# Altium project Ultrasound Smart Probe_Ver2.PrjPcb (part 1 of 9)
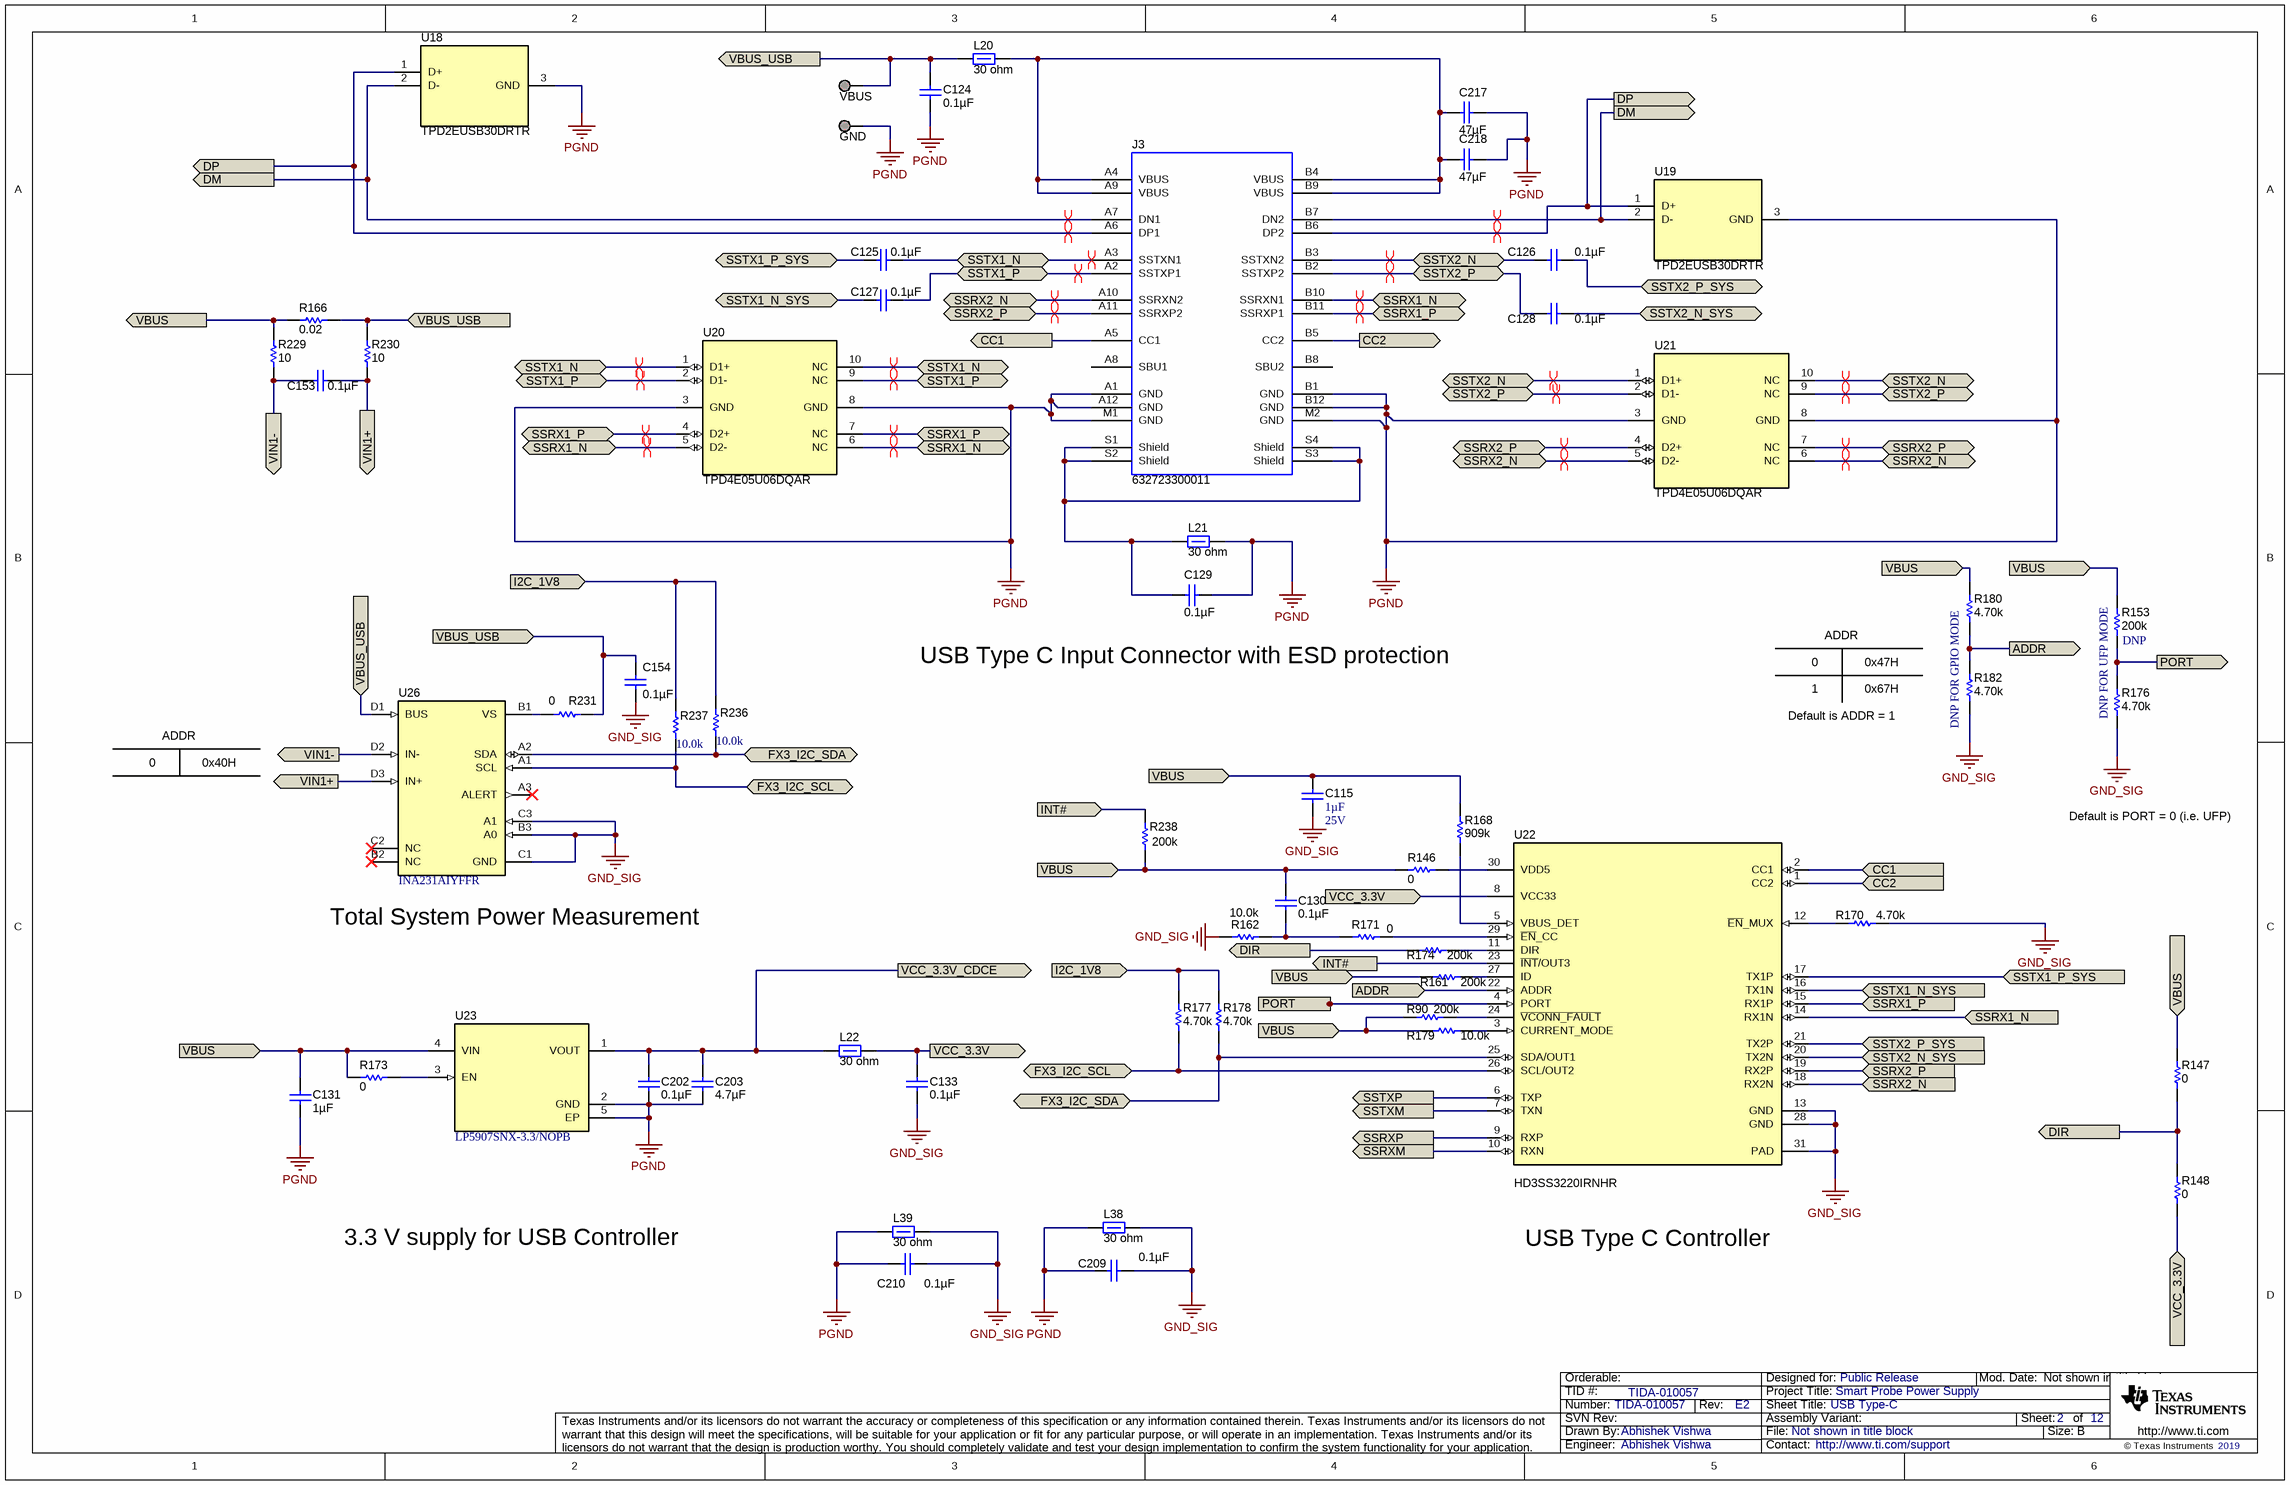
[diagram p0: USB TYPE C Interface.SchDoc]
CopyrightYear: 2019; PCB_Layout: TESSOLVE; PCB_Rev: E2; PRJ_Customer: Public Release; PRJ_Engineer: Abhishek Vishwa; PRJ_Number: TIDA-010057; PRJ_Title: Smart Probe Power Supply; SCH_Rev: E2; TechSupport: http://www.ti.com/support; TID: TIDA-010057
10 sheets, 594 parts. Net scope: flat (ports and power ports of the same name join across sheets).
Board file: TIDA_010057.PcbDoc
Sheets:
  USB TYPE C Interface.SchDoc
  FX3_Interface.SchDoc
  Input Output Connector.SchDoc
  LVPS_FX3_Supply.SchDoc
  LVPS RX Supply 1V8.SchDoc
  LVPS RX Supply 3V3 and 1V2_1.SchDoc
  LVPS FPGA.SchDoc
  LVPS TX Supply 5V and m5V.SchDoc
  High Voltage Power Supply.SchDoc
  EVM_Hardware.SchDoc

## Sheet USB TYPE C Interface.SchDoc: USB Type-C
size 431 x 279 mm; Date: Not shown in title block; ApprovedBy: Not shown in title block; CheckedBy: Not shown in title block; Author: Not shown in title block; CompanyName: Not shown in title block; DrawnBy: Abhishek Vishwa; Engineer: Not shown in title block; Organization: Not shown in title block; Address1: Not shown in title block; Address2: Not shown in title block; Address3: Not shown in title block; Address4: Not shown in title block; DocumentNumber: 1; Revision: Use project parameter SCH_Rev; SheetNumber: 2; SheetTotal: 12; PageSetup: Record=PageOptions|CenterHorizontal=True|CenterVertical=True|PrintScale=1.00|XCorrection=1.00|YCorrection=1.00|PrintKind=0|BorderSize=5000000|LeftOffset=0|BottomOffset=0|Orientation=2|PaperLength=1000|PaperWidth=1000|Scale=100|PaperSource=15|PrintQuality=600|MediaType=1|DitherType=10|PaperKind=Letter|PrintScaleMode=1; CurrentTime: Not shown in title block; CurrentDate: Not shown in title block; Time: Not shown in title block; DocumentFullPathAndName: Not shown in title block; DocumentName: Not shown in title block; ModifiedDate: Not shown in title block; ImagePath: Not shown in title block

### Parts
C115  ValueDisplayed: 1µF  VDC_V: 25V  [0402]  (hidden comment: CL05A105KA5NQNC)
C124  ValueDisplayed: 0.1µF  [0402]  (hidden comment: GRM155R61E104KA87D)
C125  ValueDisplayed: 0.1µF  [0201_033]  (hidden comment: C0603X6S1C104K030BC)
C126  ValueDisplayed: 0.1µF  [0201_033]  (hidden comment: C0603X6S1C104K030BC)
C127  ValueDisplayed: 0.1µF  [0201_033]  (hidden comment: C0603X6S1C104K030BC)
C128  ValueDisplayed: 0.1µF  [0201_033]  (hidden comment: C0603X6S1C104K030BC)
C129  ValueDisplayed: 0.1µF  [0402]  (hidden comment: GRM155R61E104KA87D)
C130  ValueDisplayed: 0.1µF  [0402]  (hidden comment: GRM155R61E104KA87D)
C131  ValueDisplayed: 1µF  [0603]  (hidden comment: 885012206052)
C133  ValueDisplayed: 0.1µF  [0402]  (hidden comment: GRM155R61E104KA87D)
C153  ValueDisplayed: 0.1µF  [0201_033]  (hidden comment: C0603X6S1C104K030BC)
C154  ValueDisplayed: 0.1µF  [0201_033]  (hidden comment: C0603X6S1C104K030BC)
C202  ValueDisplayed: 0.1µF  [0402]  (hidden comment: GRM155R61E104KA87D)
C203  ValueDisplayed: 4.7µF  [0603]  (hidden comment: GRM188R61A475MAAJ)
C209  ValueDisplayed: 0.1µF  [0402]  (hidden comment: GRM155R61E104KA87D)
C210  ValueDisplayed: 0.1µF  [0402]  (hidden comment: GRM155R61E104KA87D)
C217  ValueDisplayed: 47µF  [0603]  (hidden comment: GRM188R60J476ME15D)
C218  ValueDisplayed: 47µF  [0603]  (hidden comment: GRM188R60J476ME15D)
GND  TESTPOINT  [TP_50MIL-25MILHOLE]  (value not drawn)  (no BOM)
J3  632723300011  [Wurth_632_723_300_011]
L20  ValueDisplayed: 30 ohm  [0603]  (hidden comment: 742792609)
L21  ValueDisplayed: 30 ohm  [0603]  (hidden comment: 742792609)
L22  ValueDisplayed: 30 ohm  [0603]  (hidden comment: 742792609)
L38  ValueDisplayed: 30 ohm  [0603]  (hidden comment: 742792609)
L39  ValueDisplayed: 30 ohm  [0603]  (hidden comment: 742792609)
R90  ValueDisplayed: 200k  [0402]  (hidden comment: ERJ-2RKF2003X)
R146  ValueDisplayed: 0  [0402]  (hidden comment: ERJ-2GE0R00X)
R147  ValueDisplayed: 0  [0402]  (hidden comment: ERJ-2GE0R00X)
R148  ValueDisplayed: 0  [0402]  (hidden comment: ERJ-2GE0R00X)
R153  ValueDisplayed: 200k  VARIANT: DNP  [0402]  (hidden comment: ERJ-2RKF2003X)
R161  ValueDisplayed: 200k  [0402]  (hidden comment: ERJ-2RKF2003X)
R162  ValueDisplayed: 10.0k  [0402]  (hidden comment: ERJ-2RKF1002X)
R166  ValueDisplayed: 0.02  [1206]  (hidden comment: CSR1206FK20L0)
R168  ValueDisplayed: 909k  [0402]  (hidden comment: CRCW0402909KFKED)
R170  ValueDisplayed: 4.70k  [0402]  (hidden comment: ERJ-2RKF4701X)
R171  ValueDisplayed: 0  [0402]  (hidden comment: ERJ-2GE0R00X)
R173  ValueDisplayed: 0  [0402]  (hidden comment: ERJ-2GE0R00X)
R174  ValueDisplayed: 200k  [0402]  (hidden comment: ERJ-2RKF2003X)
R176  ValueDisplayed: 4.70k  [0402]  (hidden comment: ERJ-2RKF4701X)
R177  ValueDisplayed: 4.70k  [0402]  (hidden comment: ERJ-2RKF4701X)
R178  ValueDisplayed: 4.70k  [0402]  (hidden comment: ERJ-2RKF4701X)
R179  ValueDisplayed: 10.0k  [0402]  (hidden comment: CRCW040210K0FKED)
R180  ValueDisplayed: 4.70k  [0402]  (hidden comment: ERJ-2RKF4701X)
R182  ValueDisplayed: 4.70k  [0402]  (hidden comment: ERJ-2RKF4701X)
R229  ValueDisplayed: 10  [0201]  (hidden comment: RC0201JR-0710RL)
R230  ValueDisplayed: 10  [0201]  (hidden comment: RC0201JR-0710RL)
R231  ValueDisplayed: 0  [0201]  (hidden comment: ERJ-1GN0R00C)
R236  ValueDisplayed: 10.0k  [0201]  (hidden comment: RC0201FS-7D10KL)
R237  ValueDisplayed: 10.0k  [0201]  (hidden comment: RC0201FS-7D10KL)
R238  ValueDisplayed: 200k  [0402]  (hidden comment: ERJ-2RKF2003X)
U18  TPD2EUSB30DRTR  [DRT0003A]
U19  TPD2EUSB30DRTR  [DRT0003A]
U20  TPD4E05U06DQAR  [DQA0010A]
U21  TPD4E05U06DQAR  [DQA0010A]
U22  HD3SS3220IRNHR  [RNH0030A]
U23  LP5907SNX-3.3/NOPB  [DQN0004A]
U26  INA231AIYFFR  [YFF0012AKAD]
VBUS  TESTPOINT  [TP_50MIL-25MILHOLE]  (value not drawn)  (no BOM)

### Ports
ADDR (in), ADDR (out), CC1 (in), CC1 (out), CC2 (in), CC2 (out), DIR (out), DM (out), DP (out), FX3_I2C_SCL (bidir), FX3_I2C_SDA (bidir), I2C_1V8 (in), INT# (in), INT# (out), PORT (in), PORT (out), SSRX1_N (bidir), SSRX1_N (in), SSRX1_P (bidir), SSRX1_P (in), SSRX2_N (bidir), SSRX2_N (in), SSRX2_P (bidir), SSRX2_P (in), SSRXM (out), SSRXP (out), SSTX1_N (bidir), SSTX1_N_SYS (bidir), SSTX1_N_SYS (in), SSTX1_P (bidir), SSTX1_P_SYS (bidir), SSTX1_P_SYS (in), SSTX2_N (bidir), SSTX2_N_SYS (bidir), SSTX2_N_SYS (in), SSTX2_P (bidir), SSTX2_P_SYS (bidir), SSTX2_P_SYS (in), SSTXM (out), SSTXP (out), VBUS (in), VBUS (out), VBUS_USB (in), VBUS_USB (out), VCC_3.3V (in), VCC_3.3V (out), VCC_3.3V_CDCE (out), VIN1+ (out), VIN1- (out)

### Nets
GND_SIG: C115.2 C133.2 C154.2 C209.1 C210.1 L38.2 L39.2 R162.2 R170.1 R176.2 R182.2 U22.13(GND) U22.28(GND) U22.31(PAD) U26.B3(A0) U26.C1(GND) U26.C3(A1)
PGND: C124.1 C129.2 C131.2 C202.1 C203.2 C209.2 C210.2 C217.2 C218.2 GND.1 J3.A1(GND) J3.A12(GND) J3.B1(GND) J3.B12(GND) J3.M1(GND) J3.M2(GND) L21.2 L38.1 L39.1 U18.3(GND) U19.3(GND) U20.3(GND) U20.8(GND) U21.3(GND) U21.8(GND) U23.2(GND) U23.5(EP)
ADDR: R180.2 R182.1 U22.22(ADDR) ; port ADDR
CC1: J3.A5(CC1) U22.2(CC1) ; port CC1
CC2: J3.B5(CC2) U22.1(CC2) ; port CC2
DIR: R147.1 R148.2 R174.1 ; port DIR
DM: J3.A7(DN1) J3.B7(DN2) U18.2(D-) U19.2(D-) ; port DM
DP: J3.A6(DP1) J3.B6(DP2) U18.1(D+) U19.1(D+) ; port DP
FX3_I2C_SCL: R177.2 R237.1 U22.26(SCL/OUT2) U26.A1(SCL) ; port FX3_I2C_SCL
FX3_I2C_SDA: R178.2 R236.1 U22.25(SDA/OUT1) U26.A2(SDA) ; port FX3_I2C_SDA
I2C_1V8: R177.1 R178.1 R236.2 R237.2 ; port I2C_1V8
INT#: R238.2 U22.23(~{INT}/OUT3) ; port INT#
PORT: R153.1 R176.1 U22.4(PORT) ; port PORT
SSRX1_N: J3.B10(SSRXN1) U20.5(D2-) U20.6(NC) U22.14(RX1N) ; port SSRX1_N
SSRX1_P: J3.B11(SSRXP1) U20.4(D2+) U20.7(NC) U22.15(RX1P) ; port SSRX1_P
SSRX2_N: J3.A10(SSRXN2) U21.5(D2-) U21.6(NC) U22.18(RX2N) ; port SSRX2_N
SSRX2_P: J3.A11(SSRXP2) U21.4(D2+) U21.7(NC) U22.19(RX2P) ; port SSRX2_P
SSRXM: U22.10(RXN) ; port SSRXM
SSRXP: U22.9(RXP) ; port SSRXP
SSTX1_N: C125.1 J3.A3(SSTXN1) U20.1(D1+) U20.10(NC) ; port SSTX1_N
SSTX1_N_SYS: C127.2 U22.16(TX1N) ; port SSTX1_N_SYS
SSTX1_P: C127.1 J3.A2(SSTXP1) U20.2(D1-) U20.9(NC) ; port SSTX1_P
SSTX1_P_SYS: C125.2 U22.17(TX1P) ; port SSTX1_P_SYS
SSTX2_N: C126.2 J3.B3(SSTXN2) U21.1(D1+) U21.10(NC) ; port SSTX2_N
SSTX2_N_SYS: C128.1 U22.20(TX2N) ; port SSTX2_N_SYS
SSTX2_P: C128.2 J3.B2(SSTXP2) U21.2(D1-) U21.9(NC) ; port SSTX2_P
SSTX2_P_SYS: C126.1 U22.21(TX2P) ; port SSTX2_P_SYS
SSTXM: U22.7(TXN) ; port SSTXM
SSTXP: U22.6(TXP) ; port SSTXP
VBUS: C115.1 C130.1 C131.1 R90.2 R146.2 R147.2 R153.2 R161.1 R166.1 R168.2 R173.2 R179.1 R180.1 R229.2 R238.1 U23.4(VIN) ; port VBUS
VBUS_USB: C124.2 C154.1 L20.1 R166.2 R230.2 R231.2 U26.D1(BUS) VBUS.1 ; port VBUS_USB
VCC_3.3V: C133.1 L22.2 R148.1 U22.8(VCC33) ; port VCC_3.3V
VCC_3.3V_CDCE: C202.2 C203.1 L22.1 U23.1(VOUT) ; port VCC_3.3V_CDCE
VIN1+: C153.2 R230.1 U26.D3(IN+) ; port VIN1+
VIN1-: C153.1 R229.1 U26.D2(IN-) ; port VIN1-
NetC129_1: C129.1 J3.S1(Shield) J3.S2(Shield) J3.S3(Shield) J3.S4(Shield) L21.1
NetC130_2: C130.2 R162.1 R171.1
NetC217_1: C217.1 C218.1 J3.A4(VBUS) J3.A9(VBUS) J3.B4(VBUS) J3.B9(VBUS) L20.2
NetR90_1: R90.1 U22.24(~{VCONN_FAULT})
NetR146_1: R146.1 U22.30(VDD5)
NetR161_2: R161.2 U22.27(ID)
NetR168_1: R168.1 U22.5(VBUS_DET)
NetR170_2: R170.2 U22.12(~{EN}_MUX)
NetR171_2: R171.2 U22.29(~{EN}_CC)
NetR173_1: R173.1 U23.3(EN)
NetR174_2: R174.2 U22.11(DIR)
NetR179_2: R179.2 U22.3(CURRENT_MODE)
NetR231_1: R231.1 U26.B1(VS)

Not connected (* = marked no-connect by the designer): J3 A8(SBU1) B8(SBU2); U26 A3(ALERT)* B2(NC)* C2(NC)*

### Layout directives
differential pair: DM, DP, SSRX1_N, SSRX1_P, SSRX2_N, SSRX2_P, SSTX1_N, SSTX1_P, SSTX2_N, SSTX2_P

### Notes on the sheet
- ADDR
- (near C129) USB Type C Input Connector with ESD protection
- 0
- 1
- 0x47H
- 0x67H
- 0x40H
- Default is ADDR = 1
- DNP FOR GPIO MODE
- DNP FOR UFP MODE
- Default is PORT = 0 (i.e. UFP)
- (near U26) Total System Power Measurement
- 3.3 V supply for USB Controller
- USB Type C Controller
- Drawn By:
- SVN Rev:
- Number:
- TID #:
- Orderable:
- Rev:
- Sheet Title:
- File:
- Project Title:
- Designed for:
- Assembly Variant:
- Mod. Date:
- Sheet:
- Size:
- of
- B
- http://www.ti.com
- Texas Instruments and/or its licensors do not warrant the accuracy or completeness of this specification or any information contained therein. Texas Instruments and/or its licensors do not warrant that this design will meet the specifications, will be suitable for your application or fit for any particular purpose, or will operate in an implementation. Texas Instruments and/or its licensors do not warrant that the design is production worthy. You should completely validate and test your design implementation to confirm the system functionality for your application.
- Engineer:
- Contact:
- © Texas Instruments

### Library data of the parts
C115 = CMP-0085848-1: CAP, CERM, 1 µF, 25 V,+/- 10%, X5R, 0402; Manufacturer: Samsung Electro-Mechanics; SizeZ_mm: 0.6; AEC Category: Q200; Value: 1uF; SizeArea_mm2: 0.5; TaMax_C: 85°C; TaMin_C: -55°C; SizeX_mm: 1; AEC Qualified: N; U/M: EA; SizeAreaWB_mm2: 3; Tolerance_%: 10%; TempCo: X5R; ComponentLink1URL: http://www.samsungsem.com/kr/support/product-search/mlcc/__icsFiles/afieldfile/2018/06/19/CL05A105KA5NQNC.pdf; Cap_F: 1µF; Cap_Case: 0402; SizeY_mm: 0.5; PartNumber: CL05A105KA5NQNC; Technology: Ceramic; Value2: 25V; MountType: SMT; PackageReference: 0402; AEC Grade: N/A; CompType: Capacitor; Polarized: N; ComponentLink1Description: Datasheet link; RoHS: Y
C124 C129 C130 C133 C202 C209 C210 = GRM155R61E104KA87D: CAP, CERM, 0.1 µF, 25 V,+/- 10%, X5R, 0402; Manufacturer: MuRata; Polarized: N; CompType: Capacitor; Value: 0.1uF; U/M: EA; Cap_F: 0.0000001; Tolerance_%: 10; VDC_V: 25; Value2: 25V; TaMin_C: -55; TaMax_C: 85; SizeArea_mm2: 0.5; SizeAreaWB_mm2: 3; SizeX_mm: 1; SizeZ_mm: 0.6; AEC Category: Q200; Green_Lifecycle: Active; Green_REACh: Passed; SymbolVersion: 2008-07-09; PartNumber: GRM155R61E104KA87D; PackageReference: 0402; RoHS: Y; MountType: SMT; Technology: Ceramic; TempCo: X5R; Cap_Case: 0402; SizeY_mm: 0.5; Published: 2008-06-19; Publisher: Texas Instruments; LatestRevisionDate: 2017-06-22; ComponentLink1Description: Datasheet link; ComponentLink1URL: http://psearch.murata.com/capacitor/product/GRM155R61E104KA87%23.pdf; Supplier 1: Digi-Key; Supplier Part Number 1: 490-5920-1-ND; Supplier 2: Mouser; Supplier Part Number 2: 81-GRM155R61E104KA7D; AEC Qualified: N; AEC Grade: N/A; Green_EU RoHS: Passed; Green_EU RoHS-2: Passed
C125-C128 C153 C154 = C0603X6S1C104K030BC: CAP, CERM, 0.1 µF, 16 V,+/- 10%, X6S, 0201; Manufacturer: TDK; Polarized: N; CompType: Capacitor; Value: 0.1uF; U/M: EA; Cap_F: 0.0000001; Tolerance_%: 10; VDC_V: 16; Value2: 16V; TaMin_C: -55; TaMax_C: 105; Cap_Case: 0201; SizeArea_mm2: 0.18; SizeAreaWB_mm2: 2.08; SizeX_mm: 0.6; SizeY_mm: 0.3; SizeZ_mm: 0.33; AEC Category: Q200; SymbolVersion: 2008-07-09; PartNumber: C0603X6S1C104K030BC; PackageReference: 0201; RoHS: Y; MountType: SMT; Technology: Ceramic; TempCo: X6S; Published: 2008-06-19; Publisher: Texas Instruments; LatestRevisionDate: 2017-06-22; ComponentLink1Description: Datasheet link; ComponentLink1URL: http://product.tdk.com/en/catalog/datasheets/mlcc_commercial_general_en.pdf; Supplier 1: Digi-Key; Supplier Part Number 1: 445-15903-1-ND; Supplier 2: Newark; Supplier Part Number 2: 17X8592; Supplier 3: Mouser; Supplier Part Number 3: 810-C0603X6S1C104KBC; AEC Qualified: N; AEC Grade: N/A
C131 = 885012206052: CAP, CERM, 1 µF, 16 V,+/- 10%, X7R, 0603; Manufacturer: Wurth Elektronik; Polarized: N; CompType: Capacitor; Value: 1uF; U/M: EA; Cap_F: 0.000001; Tolerance_%: 10; VDC_V: 16; Value2: 16V; TaMin_C: -55; TaMax_C: 125; SizeArea_mm2: 1.28; SizeAreaWB_mm2: 4.68; SizeX_mm: 1.6; SizeY_mm: 0.8; SizeZ_mm: 1; AEC Category: Q200; Green_Lifecycle: Active; Green_REACh: Passed; SymbolVersion: 2008-07-09; PartNumber: 885012206052; PackageReference: 0603; RoHS: Y; MountType: SMT; Technology: Ceramic; TempCo: X7R; Cap_Case: 0603; Published: 2008-06-19; Publisher: Texas Instruments; LatestRevisionDate: 2017-06-22; ComponentLink1Description: Datasheet link; ComponentLink1URL: http://katalog.we-online.de/pbs/datasheet/885012206052.pdf; Supplier 1: Mouser; Supplier Part Number 1: 710-885012206052; AEC Qualified: N; AEC Grade: N/A; Green_EU RoHS: Passed; Green_EU RoHS-2: Incomplete
C203 = GRM188R61A475MAAJ: CAP, CERM, 4.7 µF, 10 V,+/- 20%, X5R, 0603; Manufacturer: MuRata; Polarized: N; CompType: Capacitor; Value: 4.7uF; U/M: EA; Cap_F: 0.0000047; Tolerance_%: 20; VDC_V: 10; Value2: 10V; TaMin_C: -55; TaMax_C: 85; SizeArea_mm2: 1.28; SizeAreaWB_mm2: 4.68; SizeX_mm: 1.6; SizeY_mm: 0.8; SizeZ_mm: 1; AEC Category: Q200; SymbolVersion: 2008-07-09; PartNumber: GRM188R61A475MAAJ; PackageReference: 0603; RoHS: Y; MountType: SMT; Technology: Ceramic; TempCo: X5R; Cap_Case: 0603; Published: 2008-06-19; Publisher: Texas Instruments; LatestRevisionDate: 2017-06-22; ComponentLink1Description: Datasheet link; ComponentLink1URL: http://psearch.en.murata.com/capacitor/product/GRM188R61A475MAAJ%23.pdf; AEC Qualified: N; AEC Grade: N/A
C217 C218 = GRM188R60J476ME15D: CAP, CERM, 47 µF, 6.3 V,+/- 20%, X5R, 0603; Manufacturer: MuRata; Polarized: N; CompType: Capacitor; Value: 47uF; U/M: EA; Cap_F: 0.000047; Tolerance_%: 20; VDC_V: 6.3; Value2: 6.3V; TaMin_C: -55; TaMax_C: 85; SizeArea_mm2: 1.28; SizeAreaWB_mm2: 4.68; SizeX_mm: 1.6; SizeY_mm: 0.8; SizeZ_mm: 1; AEC Category: Q200; Green_Lifecycle: Active; Green_REACh: Passed; SymbolVersion: 2008-07-09; PartNumber: GRM188R60J476ME15D; PackageReference: 0603; RoHS: Y; MountType: SMT; Technology: Ceramic; TempCo: X5R; Cap_Case: 0603; Published: 2008-06-19; Publisher: Texas Instruments; LatestRevisionDate: 2017-06-22; ComponentLink1Description: Datasheet link; ComponentLink1URL: http://psearch.en.murata.com/capacitor/product/GRM188R60J476ME15%23.pdf; AEC Qualified: ?; Green_EU RoHS: Passed; Green_EU RoHS-2: Incomplete
GND VBUS = TESTPOINT: TEST POINT.  No entry in BOM.; SymbolVersion: 2010-10-20; CompType: Testpoint; PackageReference: N/A; Publisher: Texas Instruments; LatestRevisionDate: 2017-05-31; LatestRevisionNote: Added Alternate PartNumber and Alternate Manufacturer parameters to appropriate components.
J3 = CMP-0080891-1: Connector, Receptacle, USB Type C, R/A; Manufacturer: Wurth Elektronik; Current_A: 3A; Gender: Female; Voltage_V: 5V; ContactFinish: Gold; Cert_UL: Y; ComponentLink1URL: http://katalog.we-online.de/em/datasheet/632723x00011.pdf; Supplier Part Number 2: 710-632723300011; Supplier 2: Mouser; Color: Black; RoHS: Y; MountType: SMT; Supplier 1: Digi-Key; PackageReference: Connector, Receptacle, USB Type C, R/A, THT/SMT; PinCount: 24; CompType: USB; PartNumber: 632723300011; Orientation: R/A; ComponentLink1Description: Datasheet URL; Supplier Part Number 1: 732-9618-1-ND
L20-L22 L38 L39 = 742792609: Ferrite Bead, 30 ohm @ 100 MHz, 3 A, 0603; Manufacturer: Wurth Elektronik; Value: 30 ohm; Imax_A: 3; DCR_ohm: 0.04; Value1: 0.04 ohm; Value2: 3A; SizeAreaWB_mm2: 4.68; SizeArea_mm2: 1.28; SizeX_mm: 1.6; SizeY_mm: 0.8; SizeZ_mm: 1; ZTyp@100MHz_Ohm: 30; Ztyp@1GHz_Ohm: 40.472; Green_Lifecycle: Active; Green_REACh: Passed; SymbolVersion: 2017-01-06; PartNumber: 742792609; CompType: Ferrite Bead; MountType: SMT; PackageReference: 0603; Published: 2014-04-30; Publisher: Texas Instruments; LatestRevisionDate: 2017-06-22; ComponentLink1Description: Datasheet link; ComponentLink1URL: http://katalog.we-online.de/pbs/datasheet/742792609.pdf; RoHS: Y; Supplier 1: Digi-Key; Supplier Part Number 1: 732-1591-1-ND; Supplier 2: Mouser; Supplier Part Number 2: 710-742792609; Green_EU RoHS: Passed; Green_EU RoHS-2: Incomplete
R90 R153 R161 R174 R238 = ERJ-2RKF2003X: RES, 200 k, 1%, 0.1 W, 0402; Manufacturer: Panasonic; CompType: Resistor; Value: 200k; Res_ohm: 200000; Tolerance_%: 1; Power_W: 0.1; Value2: 0.1W; VDC_V: 50; TempCo: 100 ppm/C; SizeArea_mm2: 0.5; SizeZ_mm: 0.6; EIA_Code: E96; U/M: EA; AEC Category: Q200; Green_Lifecycle: Active; Green_REACh: Passed; SymbolVersion: 2009-05-29; PartNumber: ERJ-2RKF2003X; PackageReference: 0402; RoHS: Y; Value_Code: 200k; Value1: 1%; MountType: SMT; Technology: Thick Film; SizeX_mm: 1; SizeY_mm: 0.5; Published: 2008-06-26; Publisher: Texas Instruments; LatestRevisionDate: 2017-06-12; ComponentLink1Description: Datasheet link; ComponentLink1URL: http://industrial.panasonic.com/www-data/pdf/AOA0000/AOA0000CE2.pdf; Supplier 1: Digi-Key; Supplier Part Number 1: P200KLCT-ND; Supplier 2: Newark; Supplier Part Number 2: 73T6488; Supplier 3: Mouser; Supplier Part Number 3: 667-ERJ-2RKF2003X; AEC Qualified: ?; Green_EU RoHS: Passed with Exemption; Green_EU RoHS-2: Incomplete
R146-R148 R171 R173 = ERJ-2GE0R00X: RES, 0, 5%, 0.063 W, 0402; Manufacturer: Panasonic; CompType: Resistor; Value: 0; Value_Code: 0000; Tolerance_%: 5; Power_W: 0.063; Value2: 0.063W; VDC_V: 50; TempCo: 600 ppm/C; SizeArea_mm2: 0.5; SizeX_mm: 1; SizeZ_mm: 0.6; EIA_Code: E24; U/M: EA; AEC Category: Q200; Green_Lifecycle: Active; Green_REACh: Passed; SymbolVersion: 2009-05-29; PartNumber: ERJ-2GE0R00X; PackageReference: 0402; RoHS: Y; Res_ohm: 0; Value1: 5%; MountType: SMT; Technology: Thick Film; SizeY_mm: 0.5; Published: 2008-06-26; Publisher: Texas Instruments; LatestRevisionDate: 2017-06-12; ComponentLink1Description: Datasheet link; ComponentLink1URL: http://www.panasonic.com/industrial/components/pdf/AOA0000CE1.pdf; Supplier 1: Digi-Key; Supplier Part Number 1: P0.0JCT-ND; Supplier 2: Newark; Supplier Part Number 2: 65T8307; Supplier 3: Mouser; Supplier Part Number 3: 667-ERJ-2GE0R00X; AEC Qualified: ?; Green_EU RoHS: Passed with Exemption; Green_EU RoHS-2: Passed
R162 = ERJ-2RKF1002X: RES, 10.0 k, 1%, 0.1 W, 0402; Manufacturer: Panasonic; CompType: Resistor; Value: 10.0k; Res_ohm: 10000; Value_Code: 10k0; Tolerance_%: 1; Power_W: 0.1; Value2: 0.1W; VDC_V: 50; TempCo: 100 ppm/C; SizeArea_mm2: 0.5; SizeZ_mm: 0.6; EIA_Code: E96; U/M: EA; AEC Category: Q200; Green_Lifecycle: Active; Green_REACh: Passed; SymbolVersion: 2009-05-29; PartNumber: ERJ-2RKF1002X; PackageReference: 0402; RoHS: Y; Value1: 1%; MountType: SMT; Technology: Thick Film; SizeX_mm: 1; SizeY_mm: 0.5; Published: 2008-06-26; Publisher: Texas Instruments; LatestRevisionDate: 2017-06-12; ComponentLink1Description: Datasheet link; ComponentLink1URL: http://industrial.panasonic.com/www-data/pdf/AOA0000/AOA0000CE2.pdf; Supplier 1: Digi-Key; Supplier Part Number 1: P10.0KLCT-ND; Supplier 2: Newark; Supplier Part Number 2: 90W2949; Supplier 3: Mouser; Supplier Part Number 3: 667-ERJ-2RKF1002X; AEC Qualified: ?; Green_EU RoHS: Passed with Exemption; Green_EU RoHS-2: Passed
R166 = CSR1206FK20L0: RES, 0.02, 1%, 0.5 W, 1206; Manufacturer: Stackpole Electronics Inc; CompType: Resistor; Value: 0.02; Value_Code: R020; Tolerance_%: 1; Power_W: 0.5; Value2: 0.5W; TempCo: 100 ppm/C; SizeArea_mm2: 5.12; SizeX_mm: 3.2; SizeY_mm: 1.6; SizeZ_mm: 1.35; EIA_Code: E96; U/M: EA; AEC Category: Q200; SymbolVersion: 2009-05-29; PartNumber: CSR1206FK20L0; PackageReference: 1206; RoHS: Y; Res_ohm: 0.02; Value1: 1%; MountType: SMT; Technology: Thick Film; Published: 2008-06-26; Publisher: Texas Instruments; LatestRevisionDate: 2017-06-12; ComponentLink1Description: Datasheet link; ComponentLink1URL: http://www.seielect.com/Catalog/SEI-csr.pdf; Supplier 1: Digi-Key; Supplier Part Number 1: CSR1206FK20L0CT-ND; AEC Qualified: ?
R168 = CRCW0402909KFKED: RES, 909 k, 1%, 0.063 W, 0402; Manufacturer: Vishay-Dale; CompType: Resistor; Value: 909k; Res_ohm: 909000; Tolerance_%: 1; Power_W: 0.063; Value2: 0.063W; VDC_V: 50; TempCo: 100 ppm/C; SizeArea_mm2: 0.5; SizeZ_mm: 0.6; EIA_Code: E96; U/M: EA; AEC Category: Q200; SymbolVersion: 2009-05-29; PartNumber: CRCW0402909KFKED; PackageReference: 0402; RoHS: Y; Value_Code: 909k; Value1: 1%; MountType: SMT; Technology: Thick Film; SizeX_mm: 1; SizeY_mm: 0.5; Published: 2008-06-26; Publisher: Texas Instruments; LatestRevisionDate: 2017-06-12; ComponentLink1Description: Datasheet link; ComponentLink1URL: http://www.vishay.com/docs/20035/dcrcwe3.pdf; Supplier 1: Digi-Key; Supplier Part Number 1: 541-909KLCT-ND; Supplier 2: Newark; Supplier Part Number 2: 52K7340; Supplier 3: Mouser; Supplier Part Number 3: 71-CRCW0402909KFKED; AEC Qualified: ?
R170 R176-R178 R180 R182 = ERJ-2RKF4701X: RES, 4.70 k, 1%, 0.1 W, 0402; Manufacturer: Panasonic; CompType: Resistor; Value: 4.70k; Res_ohm: 4700; Value_Code: 4k70; Tolerance_%: 1; Power_W: 0.1; Value2: 0.1W; VDC_V: 50; TempCo: 100 ppm/C; SizeArea_mm2: 0.5; SizeZ_mm: 0.6; U/M: EA; AEC Category: Q200; Green_Lifecycle: Active; Green_REACh: Passed; SymbolVersion: 2009-05-29; PartNumber: ERJ-2RKF4701X; PackageReference: 0402; RoHS: Y; Value1: 1%; MountType: SMT; Technology: Thick Film; SizeX_mm: 1; SizeY_mm: 0.5; Published: 2008-06-26; Publisher: Texas Instruments; LatestRevisionDate: 2017-06-12; ComponentLink1Description: Datasheet link; ComponentLink1URL: http://industrial.panasonic.com/www-data/pdf/AOA0000/AOA0000CE2.pdf; Supplier 1: Digi-Key; Supplier Part Number 1: P4.70KLCT-ND; Supplier 2: Newark; Supplier Part Number 2: 64R5288; Supplier 3: Mouser; Supplier Part Number 3: 667-ERJ-2RKF4701X; AEC Qualified: ?; Green_EU RoHS: Passed with Exemption; Green_EU RoHS-2: Passed
R179 = CRCW040210K0FKED: RES, 10.0 k, 1%, 0.063 W, 0402; Manufacturer: Vishay-Dale; CompType: Resistor; Value: 10.0k; Res_ohm: 10000; Value_Code: 10k0; Tolerance_%: 1; Power_W: 0.063; Value2: 0.063W; VDC_V: 50; TempCo: 100 ppm/C; SizeArea_mm2: 0.5; SizeZ_mm: 0.6; EIA_Code: E96; U/M: EA; AEC Category: Q200; Green_Lifecycle: Active; Green_REACh: Passed; SymbolVersion: 2009-05-29; PartNumber: CRCW040210K0FKED; PackageReference: 0402; RoHS: Y; Value1: 1%; MountType: SMT; Technology: Thick Film; SizeX_mm: 1; SizeY_mm: 0.5; Published: 2008-06-26; Publisher: Texas Instruments; LatestRevisionDate: 2017-06-12; ComponentLink1Description: Datasheet link; ComponentLink1URL: http://www.vishay.com/docs/20035/dcrcwe3.pdf; Supplier 1: Digi-Key; Supplier Part Number 1: 541-10.0KLCT-ND; Supplier 2: Newark; Supplier Part Number 2: 52K6595; Supplier 3: Mouser; Supplier Part Number 3: 71-CRCW0402-10K-E3; AEC Qualified: ?; Green_EU RoHS: Passed with Exemption; Green_EU RoHS-2: Passed
R229 R230 = RC0201JR-0710RL: RES, 10, 5%, 0.05 W, 0201; Manufacturer: Yageo America; CompType: Resistor; Value: 10; Value_Code: 10R0; Tolerance_%: 5; Power_W: 0.05; Value2: 0.05W; VDC_V: 25; TempCo: 350 ppm/C; SizeArea_mm2: 0.18; SizeX_mm: 0.6; SizeY_mm: 0.3; SizeZ_mm: 0.26; EIA_Code: E24; U/M: EA; AEC Category: Q200; AEC Qualified: N; SymbolVersion: 2009-05-29; PartNumber: RC0201JR-0710RL; PackageReference: 0201; RoHS: Y; Res_ohm: 10; Value1: 5%; MountType: SMT; Technology: Thick Film; Published: 2016-10-14; Publisher: Texas Instruments; LatestRevisionDate: 2017-04-07; ComponentLink1Description: Datasheet link; ComponentLink1URL: http://www.yageo.com/documents/recent/PYu-RC_Group_51_RoHS_L_5.pdf; Supplier 1: Digi-Key; Supplier Part Number 1: 311-10NCT-ND; Supplier 2: Mouser; Supplier Part Number 2: 603-RC0201JR-0710RL; AEC Grade: N/A
R231 = ERJ-1GN0R00C: RES, 0, 5%, 0.05 W, AEC-Q200 Grade 0, 0201; Manufacturer: Panasonic; CompType: Resistor; Value: 0; Value_Code: 0000; Tolerance_%: 5; Power_W: 0.05; Value2: 0.05W; TempCo: ppm/C; SizeArea_mm2: 0.18; SizeX_mm: 0.6; SizeY_mm: 0.3; SizeZ_mm: 0.26; EIA_Code: E24; U/M: EA; AEC Category: Q200; AEC Qualified: Y; SymbolVersion: 2009-05-29; PartNumber: ERJ-1GN0R00C; PackageReference: 0201; RoHS: Y; Res_ohm: 0; Value1: 5%; MountType: SMT; Technology: Thick Film; Published: 2016-10-14; Publisher: Texas Instruments; LatestRevisionDate: 2017-04-07; ComponentLink1Description: Datasheet link; ComponentLink1URL: https://industrial.panasonic.com/cdbs/www-data/pdf/RDA0000/AOA0000C281.pdf; Supplier 1: Digi-Key; Supplier Part Number 1: P15979CT-ND; Supplier 2: Newark; Supplier Part Number 2: 51W5934; Supplier 3: Mouser; Supplier Part Number 3: 667-ERJ-1GN0R00C; AEC Grade: 0
R236 R237 = CMP-0028071-1: RES SMD 10K OHM 1% 1/20W 0201; Manufacturer: Samsung Electro-Mechanics; PartNumber: RC0603F103CS; Power_W: 50mW; TempCo: 200 ppm/C; Value_Code: 10k0; U/M: EA; Value: 10.0k; EIA_Code: E96; SizeX_mm: 0.6; SizeY_mm: 0.3; SizeZ_mm: 0.26; Value2: 0.05W; SizeArea_mm2: 0.18; AEC Qualified: N; VDC_V: 25V; AEC Category: Q200; ComponentLink1URL: http://www.yageo.com/documents/recent/PYu-RC_Group_51_RoHS_L_5.pdf; Publisher: Texas Instruments; Published: 2016-10-14; RoHS: Y; Value1: 1%; MountType: SMT; Supplier 1: Digi-Key; PackageReference: 0201; Tolerance_%: 1%; Res_ohm: 10k; CompType: Resistor; LatestRevisionDate: 2017-03-09; ComponentLink1Description: Datasheet link; AEC Grade: N/A; Supplier Part Number 1: 1276-3670-1-ND; Technology: Thick Film
U18 U19 = CMP-0043104-2: ESD Solution for Super-Speed (6 Gbps) USB 3.0 Interface, 2 Channels, -40 to +85 degC, 3-pin SOT (DRT), Green (Rohs & No Sb/Br); Manufacturer: Texas Instruments; IO Leakage Current(nA): 10; HDMI: TRUE; IO Capacitance(Typ)(pF): 0.7; Breakdown Voltage(Min)(V): 9; Differential Capacitance(pF): 0.01; IEC 61000-4-2 Air-Gap(+/- kV): 8; ComponentLink1URL: http://www.ti.com/general/docs/lit/getliterature.tsp?genericPartNumber=TPD2EUSB30&fileType=pdf; PackageDescription: 3-Flat Lead Plastic Small Outline, 1 x 1 mm (inc leads), 0.35 mm Pitch; 1394 / Firewire: TRUE; ComponentLink2URL: SamplesURL:http://www.ti.com/product/tpd2eusb30#samples; Serial ATA / eSATA: TRUE; Eco-Plan: Green (RoHS & no Sb/Br); USB High Speed: TRUE; ComponentLink2Description: URL Link1; USB Super Speed: TRUE; PackageReference: DRT0003A; DatasheetVersion: SLVSAC2C; SubFamily: ESD Solution; PartNumber: TPD2EUSB30DRTR; USB Full Speed: TRUE; PackageVersion: revD, Jun-2008; Mounting Technology: Surface Mount; ComponentLink1Description: Datasheet; IEC 61000-4-2 Contact(+/- kV): 8
U20 U21 = CMP-0073613-3: 4-Channel Ultra-Low-Capacitance IEC ESD Protection Diode, DQA0010A (USON-10); Alternate Manufacturer: Texas Instruments; Green_Lifecycle: Active; SizeAreaWB_mm2: 7.0; Green_REACh: Passed; SizeZ_mm: 0.55; SizeX_mm: 1.0; SizeY_mm: 2.5; CompType: IC; AEC Category: Q200; AEC Qualified: N; ComponentLink1URL: http://www.ti.com/lit/ds/symlink/tpd4e05u06.pdf; PackageDescription: USON-10; RoHS: Y; MountType: SMT; Green_EU RoHS-2: Passed; Manufacturer: Texas Instruments; Green_EU RoHS: Passed; PackageReference: DQA0010A; SizeArea_mm2: 2.5; PartNumber: TPD4E05U06DQAR; ComponentLink1Description: Datasheet Link; ComponentLink2Description: Product Folder; ComponentLink2URL: http://www.ti.com/product/tpd4e05u06; ComponentLink3Description: Online Datasheet; ComponentLink3URL: http://www.ti.com/product/tpd4e05u06/datasheet
U22 = CMP-0076040-1: USB Type-C DRP Port Controller with SuperSpeed 2:1 MUX, RNH0030A (WQFN-30); Manufacturer: Texas Instruments; Alternate PartNumber: HD3SS3220IRNHT; SizeAreaWB_mm2: 19.25; SizeArea_mm2: 11.25; SizeZ_mm: 0.8; SizeY_mm: 4.5; U/M: EA; CompType: IC; SizeX_mm: 2.5; ComponentLink1Description: Datasheet Link; RoHS: Y; PackageReference: RNH0030A; PartNumber: HD3SS3220IRNHR; Publisher: Texas Instruments; PackageDescription: WQFN-30; Alternate Manufacturer: Texas Instruments; ComponentLink1URL: http://www.ti.com/lit/ds/symlink/hd3ss3220.pdf; LatestRevisionDate: 2017-06-09; MountType: SMT
U23 = CMP-0076246-1: 250-mA Ultra-Low-Noise, Low-IQ LDO, DQN0004A (X2SON-4); Manufacturer: Texas Instruments; SizeAreaWB_mm2: 4.0; SizeArea_mm2: 1.0; SizeZ_mm: 0.4; Green_REACh: Passed; Green_Lifecycle: Active; U/M: EA; CompType: IC; ComponentLink1Description: Datasheet Link; RoHS: Y; Green_EU RoHS: Passed; PackageReference: DQN0004A; PartNumber: LP5907SNX-3.3/NOPB; Publisher: Texas Instruments; PackageDescription: X2SON-4; SizeY_mm: 1.0; Alternate Manufacturer: Texas Instruments; LatestRevisionDate: 2017-06-09; ComponentLink1URL: http://www.ti.com/lit/ds/symlink/lp5907.pdf; MountType: SMT; SizeX_mm: 1.0; Green_EU RoHS-2: Passed
U26 = CMP-0065450-1: 28-V, Bi-Directional, Zero-Drift, Low-/High-Side, I2C Out Current/Power Monitor w/ Alert in WCSP, YFF0012AKAD (DSBGA-12); Alternate PartNumber: INA231AIYFFT; Alternate Manufacturer: Texas Instruments; Green_Lifecycle: Active; SizeAreaWB_mm2: 6.313872; Green_REACh: Passed; U/M: EA; SizeZ_mm: 0.625; SizeX_mm: 1.388; SizeY_mm: 1.644; SizeArea_mm2: 2.281872; CompType: IC; ComponentLink1URL: http://www.ti.com/lit/ds/symlink/ina231.pdf; Publisher: Texas Instruments; PackageDescription: DSBGA-12; RoHS: Y; Footprint Path 6: C:\AltiumLibraries\Footprints\TI\.PcbLib; MountType: SMT; Green_EU RoHS-2: Passed; Manufacturer: Texas Instruments; Green_EU RoHS: Passed; PackageReference: YFF0012AKAD; LatestRevisionDate: 2017-06-09; PartNumber: INA231AIYFFR; ComponentLink1Description: Datasheet Link